# Altium project MXB-0036-B01.PrjPcb
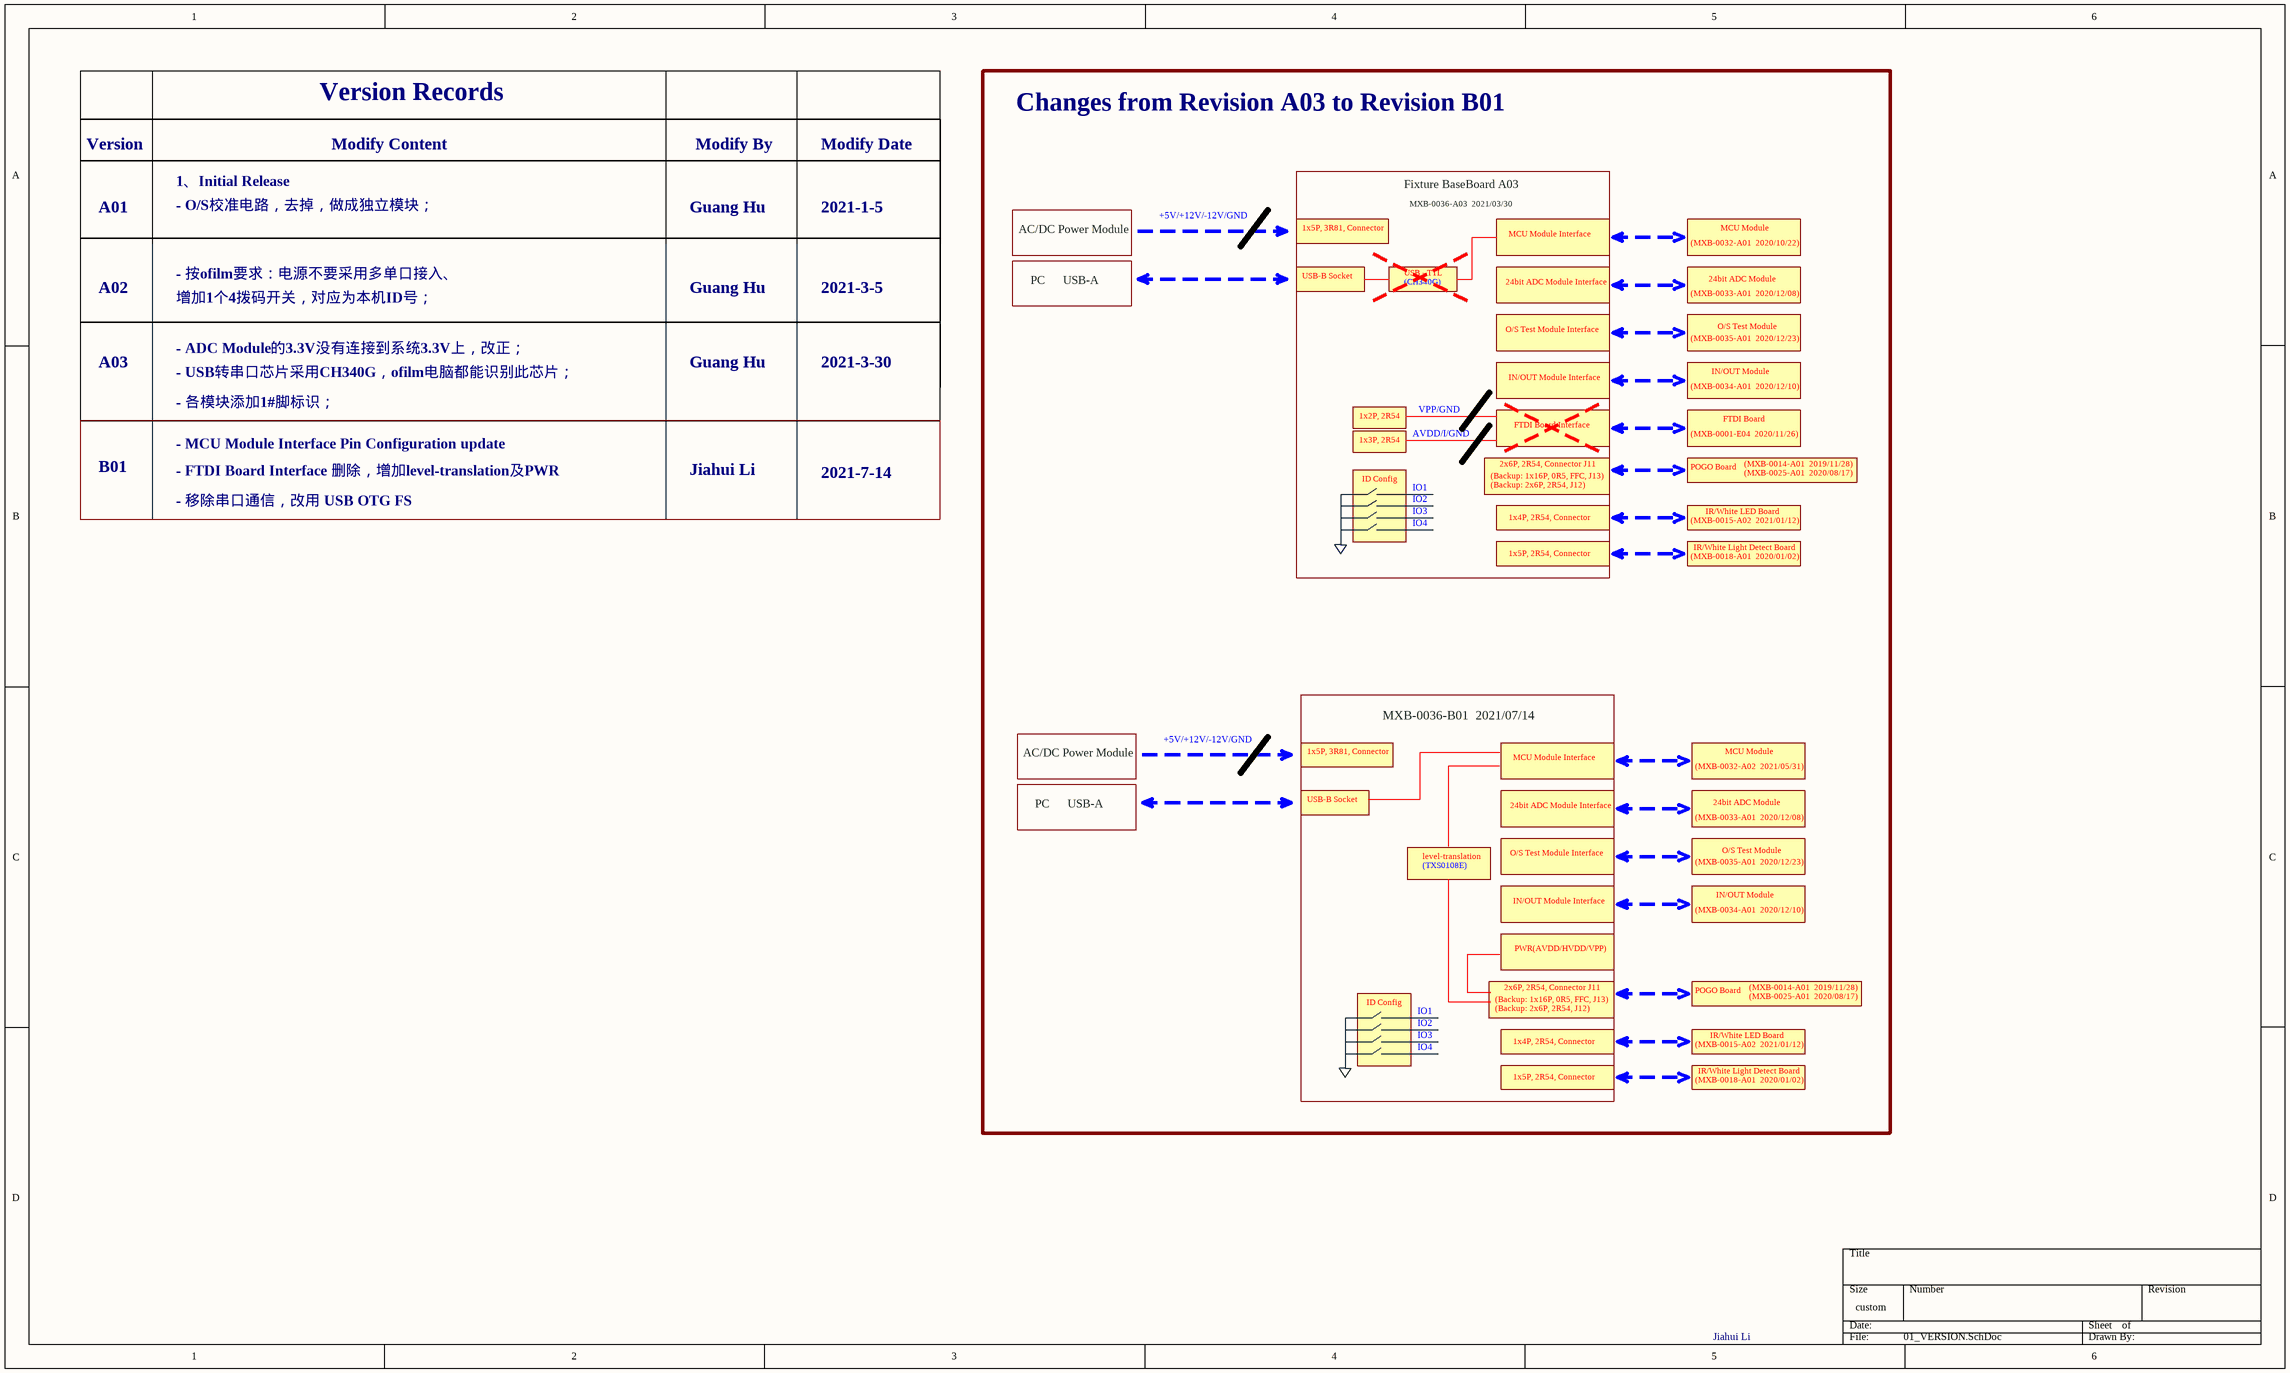
[diagram p0: 01_VERSION.SchDoc]
2 sheets, 157 parts. Net scope: global (net labels, ports and power ports of the same name join across sheets).
Board file: BaseBoard B01.PcbDoc
Sheets:
  01_VERSION.SchDoc
  02_Fixture BaseBoard B01.SchDoc

## Sheet 01_VERSION.SchDoc: MXB-0036-B01
size 485 x 289 mm; ApprovedBy: Jiahui Li; CheckedBy: Jiahui Li; Author: Jiahui Li; CompanyName: Mixosense; DrawnBy: Jiahui Li; Engineer: Jiahui Li; Organization: Mixosense; Revision: B01; SheetNumber: 1; SheetTotal: 2

### Notes on the sheet
- Version Records
- Changes from Revision A03 to Revision B01
- Version
- 1、Initial Release
- Modify Content
- Modify By
- Modify Date
- Fixture BaseBoard A03
- A01
- - O/S校准电路，去掉，做成独立模块；
- Guang Hu
- 2021-1-5
- AC/DC Power Module
- +5V/+12V/-12V/GND
- 1x5P, 3R81, Connector
- MXB-0036-A03  2021/03/30
- MCU Module Interface
- (MXB-0032-A01  2020/10/22)
- MCU Module
- A02
- - 按ofilm要求：电源不要采用多单口接入、
- 增加1个4拨码开关，对应为本机ID号；
- 2021-3-5
- PC      USB-A
- USB-B Socket
- USB - TTL
- (CH340G)
- 24bit ADC Module Interface
- (MXB-0033-A01  2020/12/08)
- 24bit ADC Module
- A03
- - ADC Module的3.3V没有连接到系统3.3V上，改正；
- - USB转串口芯片采用CH340G，ofilm电脑都能识别此芯片；
- 2021-3-30
- O/S Test Module Interface
- (MXB-0035-A01  2020/12/23)
- IN/OUT Module
- O/S Test Module
- - 各模块添加1#脚标识；
- 1x2P, 2R54
- AVDD/I/GND
- VPP/GND
- IN/OUT Module Interface
- FTDI Board Interface
- (MXB-0034-A01  2020/12/10)
- (MXB-0001-E04  2020/11/26)
- FTDI Board
- B01
- - MCU Module Interface Pin Configuration update
- - FTDI Board Interface 删除，增加level-translation及PWR
- Jiahui Li
- 2021-7-14
- 1x3P, 2R54
- ID Config
- IO1
- (Backup: 1x16P, 0R5, FFC, J13)
- (Backup: 2x6P, 2R54, J12)
- 2x6P, 2R54, Connector J11
- POGO Board
- (MXB-0014-A01  2019/11/28)
- (MXB-0025-A01  2020/08/17)
- - 移除串口通信，改用 USB OTG FS
- IO2
- IO3
- IO4
- 1x4P, 2R54, Connector
- 1x5P, 2R54, Connector
- (MXB-0015-A02  2021/01/12)
- IR/White Light Detect Board
- IR/White LED Board
- (MXB-0018-A01  2020/01/02)
- MXB-0036-B01  2021/07/14
- (MXB-0032-A02  2021/05/31)
- level-translation
- (TXS0108E)
- PWR(AVDD/HVDD/VPP)

## Sheet 02_Fixture BaseBoard B01.SchDoc: MXB-0036-B01
size 485 x 289 mm; ApprovedBy: Jiahui Li; CheckedBy: Jiahui Li; Author: Jiahui Li; CompanyName: Mixosense; DrawnBy: Jiahui Li; Engineer: Jiahui Li; Organization: Mixosense; Revision: B01; SheetNumber: 2; SheetTotal: 2
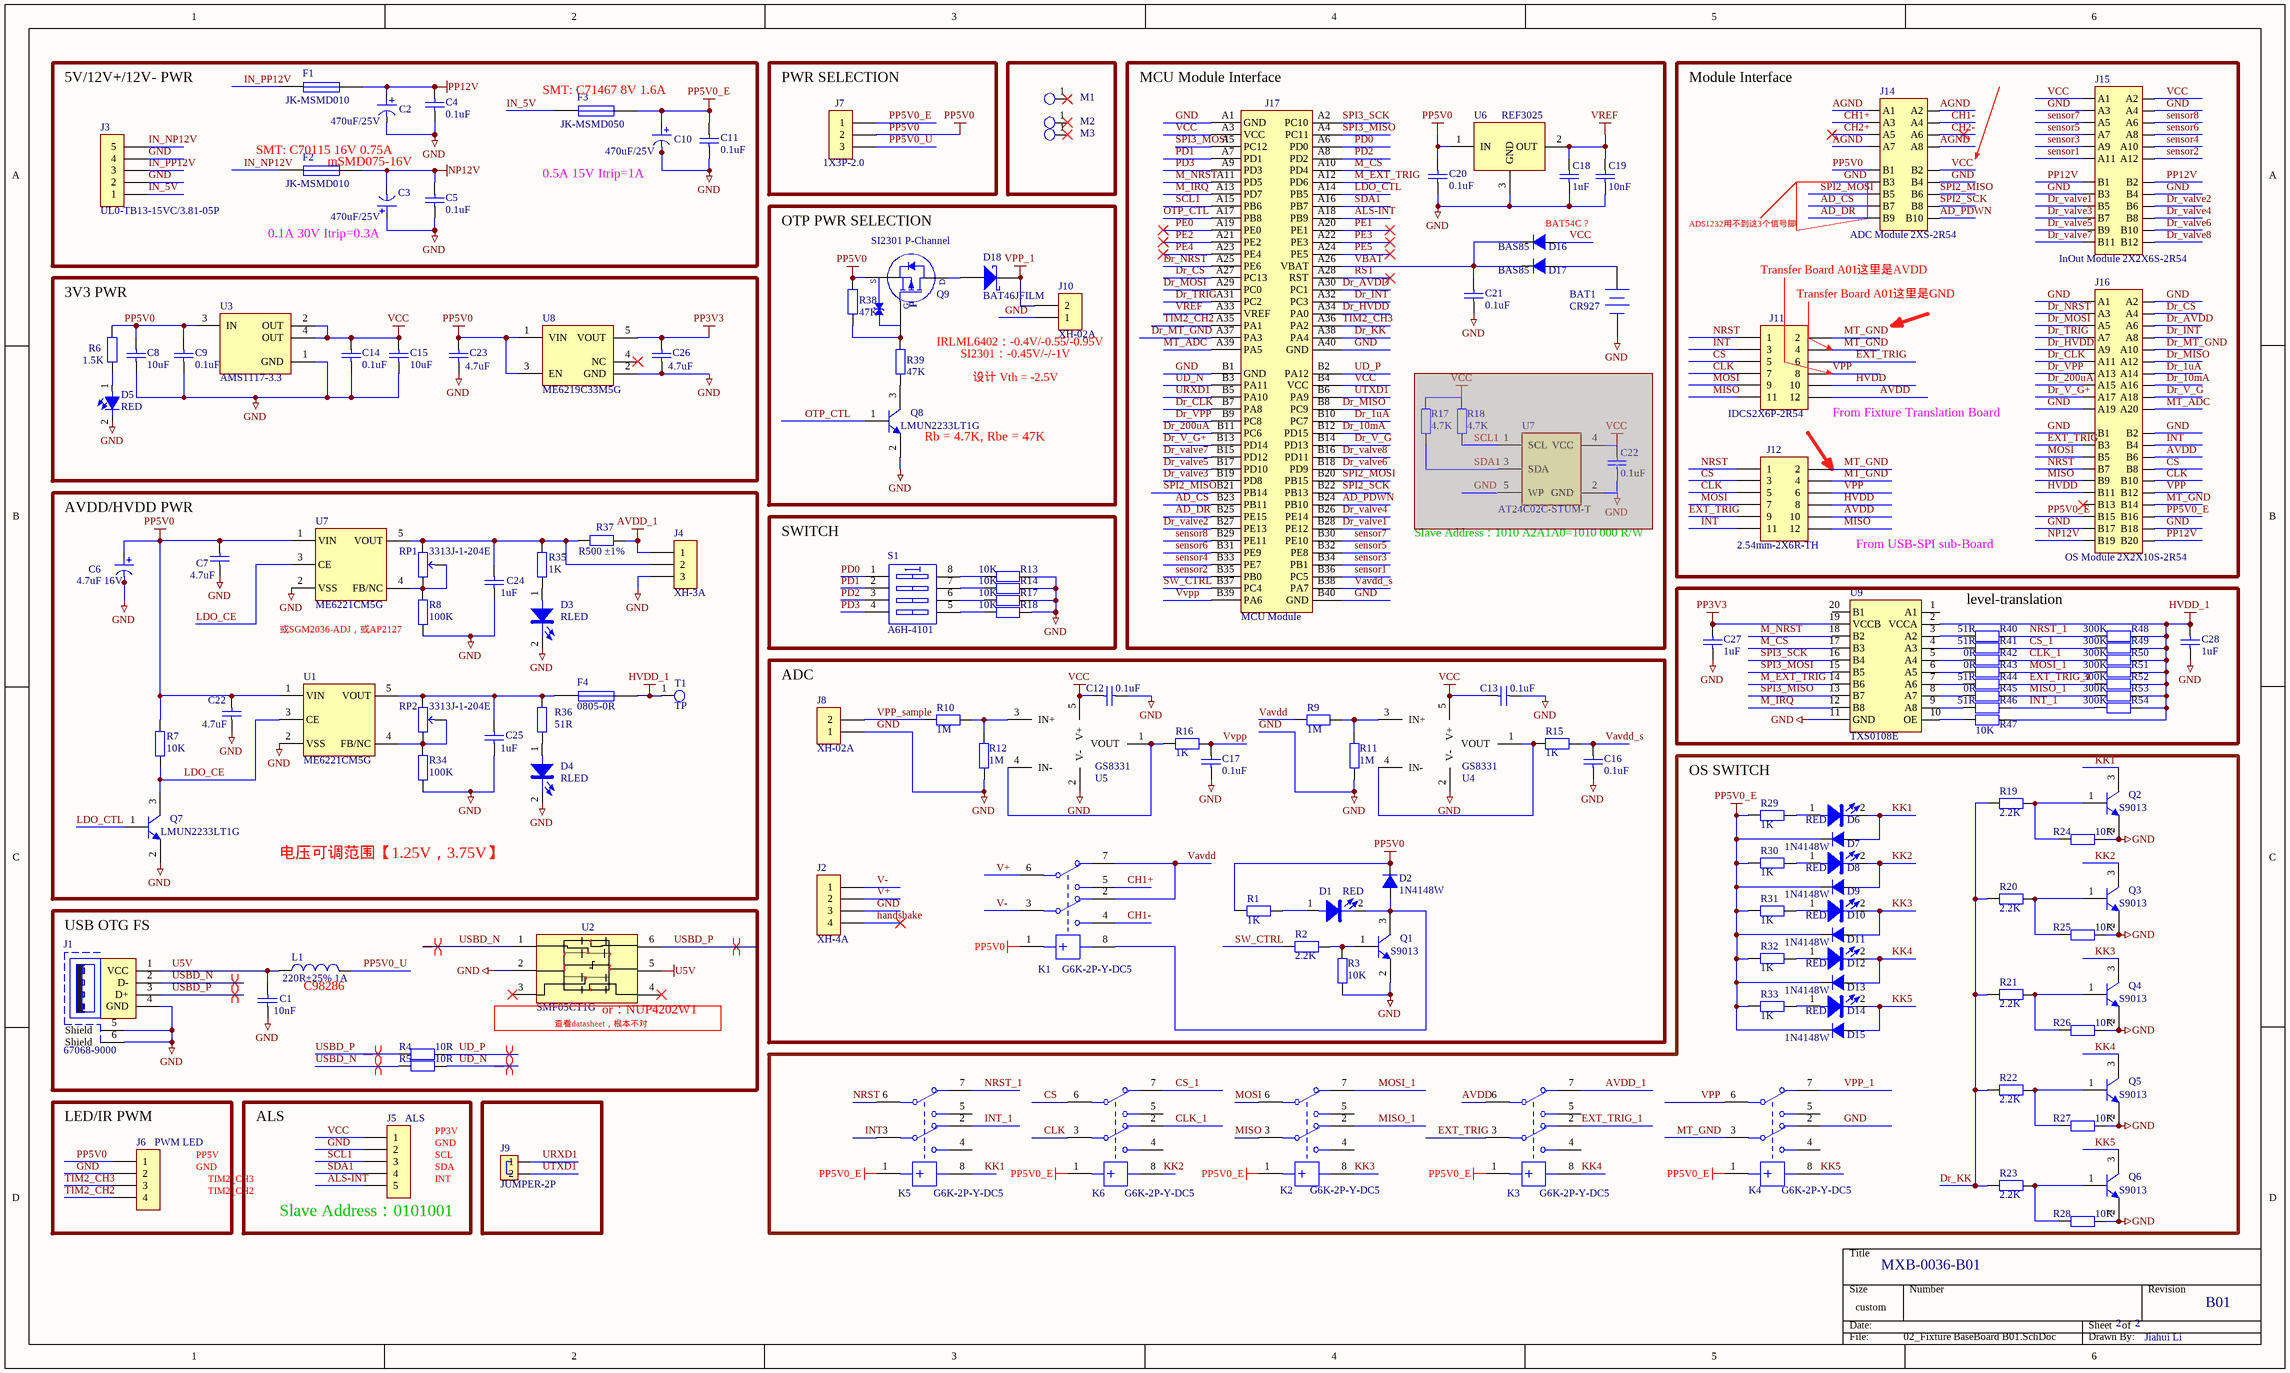
[diagram p1: 02_Fixture BaseBoard B01.SchDoc]

### Parts
(Parts that share a designator on the sheet are numbered #1, #2 ... from top to bottom, then left to right.)
BAT1  CR927  [CR2032]
C1  10nF  [HG-C0603]
C2  470uF/25V  [CE3R5-8x11R5-1mm]
C3  470uF/25V  [CE3R5-8x11R5-1mm]
C4  0.1uF  [HG-C0603]
C5  0.1uF  [HG-C0603]
C6  4.7uF 16V  [HG-C3216]
C7  4.7uF  [HG-C0402]
C8  10uF  [C0805]
C9  0.1uF  [HG-C0603]
C10  470uF/25V  [CE3R5-8x11R5-1mm]
C11  0.1uF  [HG-C0603]
C12  0.1uF  [HG-C0603]
C13  0.1uF  [HG-C0603]
C14  0.1uF  [HG-C0603]
C15  10uF  [C0805]
C16  0.1uF  [HG-C0603]
C17  0.1uF  [HG-C0603]
C18  1uF  [HG-C0603]
C19  10nF  [HG-C0603]
C20  0.1uF  [HG-C0603]
C21  0.1uF  [HG-C0603]
C22#1  0.1uF  [HG-C0603]  (masked out: inside a compile mask, not in the netlist)
C22#2  4.7uF  [HG-C0402]
C23  4.7uF  [HG-C0402]
C24  1uF  [HG-C0402]
C25  1uF  [HG-C0402]
C26  4.7uF  [HG-C0402]
C27  1uF  [HG-C0402]
C28  1uF  [HG-C0402]
D1  RED  [HG_LED_0603]
D2  1N4148W  [SOD-123]
D3  RLED  [HG_LED_0603]
D4  RLED  [HG_LED_0603]
D5  RED  [HG_LED_0603]
D6  RED  [HG_LED_0603]
D7  1N4148W  [SOD-123]
D8  RED  [HG_LED_0603]
D9  1N4148W  [SOD-123]
D10  RED  [HG_LED_0603]
D11  1N4148W  [SOD-123]
D12  RED  [HG_LED_0603]
D13  1N4148W  [SOD-123]
D14  RED  [HG_LED_0603]
D15  1N4148W  [SOD-123]
D16  BAS85  [SOD-80C]
D17  BAS85  [SOD-80C]
D18  BAT46JFILM  [SOD-323]
F1  JK-MSMD010  [FUSE-1812]
F2  JK-MSMD010  [FUSE-1812]
F3  JK-MSMD050  [FUSE-1812]
F4  0805-0R  [FUSE-0805]
J1  67068-9000  [USB-B-TH-W]
J2  XH-4A  [XH4P-2R54]
J3  UL0-TB13-15VC/3.81-05P  [2EDG5P-3R81-TH]
J4  XH-3A  [XH3P-2R54]
J5  ALS  [XH5P-2R5-TH]
J6  PWM LED  [XH4P-2R54-TH]
J7  1X3P-2.0  [CON3P-2R0]
J8  XH-02A  [XH2P-2R54]
J9  JUMPER-2P  [CON2P-2R0]
J10  XH-02A  [XH2P-2R54]
J11  IDCS2X6P-2R54  [IDCS2X6P-2R54-TH]
J12  2.54mm-2X6R-TH  [CON2X6R-2R54-TH]
J14  ADC Module 2XS-2R54  [ADC MODULE]
J15  InOut Module 2X2X6S-2R54  [INOUT MODULE]
J16  OS Module 2X2X10S-2R54  [OS MODULE]
J17  MCU Module  [MCU MODULE]
K1  G6K-2P-Y-DC5  [G6K-2P]
K2  G6K-2P-Y-DC5  [G6K-2P]
K3  G6K-2P-Y-DC5  [G6K-2P]
K4  G6K-2P-Y-DC5  [G6K-2P]
K5  G6K-2P-Y-DC5  [G6K-2P]
K6  G6K-2P-Y-DC5  [G6K-2P]
L1  220R±25% 1A  [L0603]
M1  (no value)  [MARK PAD]
M2  (no value)  [MARK PAD]
M3  (no value)  [MARK PAD]
Q1  S9013  [SOT-23-3]
Q2  S9013  [SOT-23-3]
Q3  S9013  [SOT-23-3]
Q4  S9013  [SOT-23-3]
Q5  S9013  [SOT-23-3]
Q6  S9013  [SOT-23-3]
Q7  LMUN2233LT1G  [SOT-23-3]
Q8  LMUN2233LT1G  [SOT-23-3]
Q9  SI2301 P-Channel  [SOT-23-MOS]
R1  1K  [HG-R0603]
R2  2.2K  [HG-R0603]
R3  10K  [HG-R0603]
R4  10R  [HG-R0603]
R5  10R  [HG-R0603]
R6  1.5K  [HG-R0603]
R7  10K  [HG-R0402]
R8  100K  [HG-R0402]
R9  1M  [HG-R0603]
R10  1M  [HG-R0603]
R11  1M  [HG-R0603]
R12  1M  [HG-R0603]
R13  10K  [HG-R0603]
R14  10K  [HG-R0603]
R15  1K  [HG-R0603]
R16  1K  [HG-R0603]
R17#1  4.7K  [HG-R0603]  (masked out: inside a compile mask, not in the netlist)
R17#2  10K  [HG-R0603]
R18#1  4.7K  [HG-R0603]  (masked out: inside a compile mask, not in the netlist)
R18#2  10K  [HG-R0603]
R19  2.2K  [HG-R0603]
R20  2.2K  [HG-R0603]
R21  2.2K  [HG-R0603]
R22  2.2K  [HG-R0603]
R23  2.2K  [HG-R0603]
R24  10K  [HG-R0603]
R25  10K  [HG-R0603]
R26  10K  [HG-R0603]
R27  10K  [HG-R0603]
R28  10K  [HG-R0603]
R29  1K  [HG-R0603]
R30  1K  [HG-R0603]
R31  1K  [HG-R0603]
R32  1K  [HG-R0603]
R33  1K  [HG-R0603]
R34  100K  [HG-R0402]
R35  1K  [HG-R0402]
R36  51R  [HG-R0402]
R37  R500 ±1%  [HG-R0603]
R38  47K  [HG-R0402]
R39  47K  [HG-R0402]
R40  51R  [HG-R0402]
R41  51R  [HG-R0402]
R42  0R  [HG-R0402]
R43  0R  [HG-R0402]
R44  51R  [HG-R0402]
R45  0R  [HG-R0402]
R46  51R  [HG-R0402]
R47  10K  [HG-R0402]
R48  300K  [HG-R0402]
R49  300K  [HG-R0402]
R50  300K  [HG-R0402]
R51  300K  [HG-R0402]
R52  300K  [HG-R0402]
R53  300K  [HG-R0402]
R54  300K  [HG-R0402]
RP1  3313J-1-204E  [3313J]
RP2  3313J-1-204E  [3313J]
S1  A6H-4101  [SW-SMD-6R31X4R5X1R27-4]
T1  TP  [TEST PAD]
U1  ME6221CM5G  [SOT23-5]
U2  SMF05CT1G  [SOT-363]
U3  AMS1117-3.3  [SOT-223]
U4  GS8331  [SOT23-5]
U5  GS8331  [SOT23-5]
U6  REF3025  [SOT23-3_REF]
U7#1  AT24C02C-STUM-T  [SOT23-5]  (masked out: inside a compile mask, not in the netlist)
U7#2  ME6221CM5G  [SOT23-5]
U8  ME6219C33M5G  [SOT23-5]
U9  TXS0108E  [TSSOP20-0R65-6R5X4R4]

### Blocks framed on the sheet
5V/12V+/12V- PWR: C2-C5 C10 C11 F1-F3 J3
PWR SELECTION: J7
MCU Module Interface: BAT1 C18-C21 C22#1 D16 D17 J17 R17#1 R18#1 U6 U7#1
Module Interface: J11 J12 J14-J16
OTP PWR SELECTION: D18 J10 Q8 Q9 R38 R39
3V3 PWR: C8 C9 C14 C15 C23 C26 D5 R6 U3 U8
电压可调范围【1.25V，3.75V】: C6 C7 C22#2 C24 C25 D3 D4 F4 J4 Q7 R7 R8 R34-R37 RP1 RP2 T1 U1 U7#2
SWITCH: R13 R14 R17#2 R18#2 S1
level-translation: C27 C28 R40-R54 U9
ADC: C12 C13 C16 C17 D1 D2 J2 J8 K1 Q1 R1-R3 R9-R12 R15 R16 U4 U5
OS SWITCH: D6-D15 K2-K6 Q2-Q6 R19-R33
USB OTG FS: C1 J1 L1 R4 R5 U2
LED/IR PWM: J6
Slave Address：0101001: J5

### Nets
AVDD_1: J4.1 K3.7 R37.2
GND: BAT1.2(-) C1.2 C2.2 C3.1 C4.2 C5.2 C6.2 C7.2 C8.2 C9.2 C10.2 C11.2 C12.2 C13.2 C14.2 C15.2 C16.2 C17.2 C18.2 C19.2 C20.1 C21.1 C22#2.2 C23.2 C24.2 C25.2 C26.2 C27.2 C28.2 D3.2 D4.2 D5.2 J1.4(GND) J1.5(Shield) J1.6(Shield) J2.3 J3.2 J3.4 J4.3 J5.2 J6.2 J8.1 J10.1 J14.B3 J14.B4 J15.A3 J15.A4 J15.B3 J15.B4 J16.A1 J16.A2 J16.A19 J16.B1 J16.B2 J16.B17 J16.B18 J17.A1(GND) J17.A40(GND) J17.B1(GND) J17.B40(GND) K4.2 Q1.2(E) Q2.2(E) Q3.2(E) Q4.2(E) Q5.2(E) Q6.2(E) Q7.2(E) Q8.2(E) R3.1 R8.2 R11.1 R12.1 R13.1 R14.1 R17#2.1 R18#2.1 R24.1 R25.1 R26.1 R27.1 R28.1 R34.2 U1.2(VSS) U2.2(VN) U3.1(GND) U4.2(V-) U5.2(V-) U6.3(GND) U7#2.2(VSS) U8.2(GND) U9.11(GND)
HVDD_1: C28.1 F4.2 R47.1 R48.1 R49.1 R50.1 R51.1 R52.1 R53.1 R54.1 T1.1 U9.2(VCCA)
NP12V: C3.2 C5.1 F2.2 J16.B19
PP3V3: C26.1 C27.1 U8.5(VOUT) U9.19(VCCB)
PP5V0: C6.1 C7.1 C8.1 C9.1 C20.2 C22#2.1 C23.1 D2.2(C) J6.1 J7.2 J14.B1 K1.1 Q9.S R1.1 R6.1 R7.1 R38.2 U1.1(VIN) U3.3(IN) U6.1(IN) U7#2.1(VIN) U8.1(VIN) U8.3(EN)
PP5V0_E: C10.1 C11.1 D7.2(C) D9.2(C) D11.2(C) D13.2(C) D15.2(C) F3.2 J7.1 J16.B15 J16.B16 K2.1 K3.1 K4.1 K5.1 K6.1 R29.1 R30.1 R31.1 R32.1 R33.1
PP12V: C2.1 C4.1 F1.2 J15.B1 J15.B2 J16.B20
U5V: C1.1 J1.1(VCC) L1.1 U2.5(VP)
VCC: C12.1 C13.1 C14.1 C15.1 D16.1(A) J5.1 J14.B2 J15.A1 J15.A2 J17.A3(VCC) J17.B4(VCC) U3.2(OUT) U3.4(OUT) U4.5(V+) U5.5(V+)
VPP_1: D18.2 J10.2 K4.7
VREF: C18.1 C19.1 J17.A33(VREF) U6.2(OUT)
AD_CS: J14.B7 J17.B23(PB11)
AD_DR: J14.B9 J17.B25(PE15)
AD_PDWN: J14.B10 J17.B24(PB10)
AGND: J14.A1 J14.A2 J14.A7 J14.A8
ALS-INT: J5.5 J17.A18(PB9)
AVDD: J11.12 J12.10 J16.B6 K3.6
CH1+: J14.A3 K1.5
CH1-: J14.A4 K1.4
CH2+: J14.A5
CH2-: J14.A6
CLK: J11.7 J12.5 J16.B10 K6.3
CLK_1: K6.2 R42.1 R50.2
CS: J11.5 J12.3 J16.B8 K6.6
CS_1: K6.7 R41.1 R49.2
Dr_1uA: J16.A14 J17.B10(PC7)
Dr_10mA: J16.A16 J17.B12(PD15)
Dr_200uA: J16.A15 J17.B11(PC6)
Dr_AVDD: J16.A6 J17.A30(PC1)
Dr_CLK: J16.A11 J17.B7(PA8)
Dr_CS: J16.A4 J17.A27(PC13)
Dr_HVDD: J16.A9 J17.A34(PA0)
Dr_INT: J16.A8 J17.A32(PC3)
Dr_KK: J17.A38(PA4) R19.1 R20.1 R21.1 R22.1 R23.1
Dr_MISO: J16.A12 J17.B8(PC9)
Dr_MOSI: J16.A5 J17.A29(PC0)
Dr_MT_GND: J16.A10 J17.A37(PA3)
Dr_NRST: J16.A3 J17.A25(PE6)
Dr_TRIG: J16.A7 J17.A31(PC2)
Dr_V_G: J16.A18 J17.B14(PD13)
Dr_V_G+: J16.A17 J17.B13(PD14)
Dr_valve1: J15.B5 J17.B28(PE12)
Dr_valve2: J15.B6 J17.B27(PE13)
Dr_valve3: J15.B7 J17.B19(PD8)
Dr_valve4: J15.B8 J17.B26(PE14)
Dr_valve5: J15.B9 J17.B17(PD10)
Dr_valve6: J15.B10 J17.B18(PD9)
Dr_valve7: J15.B11 J17.B15(PD12)
Dr_valve8: J15.B12 J17.B16(PD11)
Dr_VPP: J16.A13 J17.B9(PC8)
EXT_TRIG: J11.6 J12.9 J16.B3 K3.3
EXT_TRIG_1: K3.2 R44.1 R52.2
handshake: J2.4
HVDD: J11.10 J12.8 J16.B11
IN_5V: F3.1 J3.1
IN_NP12V: F2.1 J3.5
IN_PP12V: F1.1 J3.3
INT: J11.3 J12.11 J16.B4 K5.3
INT_1: K5.2 R46.1 R54.2
KK1: D6.2 D7.1(A) K5.8 Q2.3(C)
KK2: D8.2 D9.1(A) K6.8 Q3.3(C)
KK3: D10.2 D11.1(A) K2.8 Q4.3(C)
KK4: D12.2 D13.1(A) K3.8 Q5.3(C)
KK5: D14.2 D15.1(A) K4.8 Q6.3(C)
LDO_CE: Q7.3(C) R7.2 U1.3(CE) U7#2.3(CE)
LDO_CTL: J17.A14(PB5) Q7.1(B)
M_CS: J17.A10(PD4) U9.17(B3)
M_EXT_TRIG: J17.A12(PD6) U9.14(B6)
M_IRQ: J17.A13(PD7) U9.12(B8)
M_NRST: J17.A11(PD5) U9.18(B2)
MISO: J11.11 J12.12 J16.B9 K2.3
MISO_1: K2.2 R45.1 R53.2
MOSI: J11.9 J12.7 J16.B5 K2.6
MOSI_1: K2.7 R43.1 R51.2
MT_ADC: J16.A20 J17.A39(PA5)
MT_GND: J11.2 J11.4 J12.2 J12.4 J16.B14 K4.3
NRST: J11.1 J12.1 J16.B7 K5.6
NRST_1: K5.7 R40.1 R48.2
OTP_CTL: J17.A17(PB8) Q8.1(B)
PD0: J17.A6(PD0) S1.1(A1)
PD1: J17.A7(PD1) S1.2(A2)
PD2: J17.A8(PD2) S1.3(A3)
PD3: J17.A9(PD3) S1.4(A4)
PE0: J17.A19(PE0)
PE1: J17.A20(PE1)
PE2: J17.A21(PE2)
PE3: J17.A22(PE3)
PE4: J17.A23(PE4)
PE5: J17.A24(PE5)
PP5V0_U: J7.3 L1.2
RST: J17.A28(RST)
SCL1: J5.3 J17.A15(PB6)
SDA1: J5.4 J17.A16(PB7)
sensor1: J15.A11 J17.B36(PC5)
sensor2: J15.A12 J17.B35(PB0)
sensor3: J15.A9 J17.B34(PB1)
sensor4: J15.A10 J17.B33(PE7)
sensor5: J15.A7 J17.B32(PE8)
sensor6: J15.A8 J17.B31(PE9)
sensor7: J15.A5 J17.B30(PE10)
sensor8: J15.A6 J17.B29(PE11)
SPI2_MISO: J14.B6 J17.B21(PB14)
SPI2_MOSI: J14.B5 J17.B20(PB15)
SPI2_SCK: J14.B8 J17.B22(PB13)
SPI3_MISO: J17.A4(PC11) U9.13(B7)
SPI3_MOSI: J17.A5(PC12) U9.15(B5)
SPI3_SCK: J17.A2(PC10) U9.16(B4)
SW_CTRL: J17.B37(PC4) R2.1
TIM2_CH2: J6.4 J17.A35(PA1)
TIM2_CH3: J6.3 J17.A36(PA2)
UD_N: J17.B3(PA11) R5.1
UD_P: J17.B2(PA12) R4.1
URXD1: J9.1 J17.B5(PA10)
USBD_N: J1.2(D-) R5.2 U2.1(I/O1)
USBD_P: J1.3(D+) R4.2 U2.6(I/O2)
UTXD1: J9.2 J17.B6(PA9)
V+: J2.2 K1.6
V-: J2.1 K1.3
Vavdd: K1.2 K1.7 R9.2
Vavdd_s: C16.1 J17.B38(PA7) R15.1
VBAT: C21.2 D16.2(C) D17.2(C) J17.A26(VBAT)
VPP: J11.8 J12.6 J16.B12 K4.6
VPP_sample: J8.2 R10.2
Vvpp: C17.1 J17.B39(PA6) R16.1
NetBAT1_1: BAT1.1(+) D17.1(A)
NetC24_1: C24.1 J4.2 R35.1 R37.1 RP1.1 U7#2.5(VOUT)
NetC25_1: C25.1 F4.1 R36.1 RP2.1 U1.5(VOUT)
NetD1_1: D1.1 R1.2
NetD1_2: D1.2 D2.1(A) K1.8 Q1.3(C)
NetD3_1: D3.1 R35.2
NetD4_1: D4.1 R36.2
NetD5_1: D5.1 R6.2
NetD6_1: D6.1 R29.2
NetD8_1: D8.1 R30.2
NetD10_1: D10.1 R31.2
NetD12_1: D12.1 R32.2
NetD14_1: D14.1 R33.2
NetD18_1: D18.1 Q9.D
NetQ1_1: Q1.1(B) R2.2 R3.2
NetQ2_1: Q2.1(B) R19.2 R24.2
NetQ3_1: Q3.1(B) R20.2 R25.2
NetQ4_1: Q4.1(B) R21.2 R26.2
NetQ5_1: Q5.1(B) R22.2 R27.2
NetQ6_1: Q6.1(B) R23.2 R28.2
NetQ8_3: Q8.3(C) R39.1
NetQ9_G: Q9.G R38.1 R39.2
NetR8_1: R8.1 RP1.2 RP1.3 U7#2.4(FB/NC)
NetR9_1: R9.1 R11.2 U4.3(IN+)
NetR10_1: R10.1 R12.2 U5.3(IN+)
NetR13_2: R13.2 S1.8(A8)
NetR14_2: R14.2 S1.7(A7)
NetR15_2: R15.2 U4.1(VOUT) U4.4(IN-)
NetR16_2: R16.2 U5.1(VOUT) U5.4(IN-)
NetR17#2_2: R17#2.2 S1.6(A6)
NetR18#2_2: R18#2.2 S1.5(A5)
NetR34_1: R34.1 RP2.2 RP2.3 U1.4(FB/NC)
NetR40_2: R40.2 U9.3(A2)
NetR41_2: R41.2 U9.4(A3)
NetR42_2: R42.2 U9.5(A4)
NetR43_2: R43.2 U9.6(A5)
NetR44_2: R44.2 U9.7(A6)
NetR45_2: R45.2 U9.8(A7)
NetR46_2: R46.2 U9.9(A8)
NetR47_2: R47.2 U9.10(OE)

Not connected (* = marked no-connect by the designer): J16 B13*; K2 4 5; K3 4 5; K4 4 5; K5 4 5; K6 4 5; M1 1*; M2 1*; M3 1*; U2 3(I/O3)* 4(I/O4)*; U8 4(NC)*; U9 1(A1) 20(B1)

### Layout directives
differential pair: UD_N, UD_P, USBD_N, USBD_P

### Notes on the sheet
- (near F3) SMT: C71467 8V 1.6A
- (near F2) SMT: C70115 16V 0.75A
- (near F2) mSMD075-16V
- (near C10) 0.5A 15V Itrip=1A
- (near C3) 0.1A 30V Itrip=0.3A
- (near D16) BAT54C ?
- ADS1232用不到这3个信号脚
- Transfer Board A01这里是AVDD
- (near J11) Transfer Board A01这里是GND
- (near J10) IRLML6402：-0.4V/-0.55/-0.95V
- (near J10) SI2301：-0.45V/-/-1V
- 设计 Vth = -2.5V
- (near J11) From Fixture Translation Board
- (near Q8) Rb = 4.7K, Rbe = 47K
- (near C6) AVDD/HVDD PWR
- (near U7#1) Slave Address：1010 A2A1A0=1010 000 R/W
- From USB-SPI sub-Board
- 或SGM2036-ADJ，或AP2127
- (near L1) C98286
- (near U2) 查看datasheet，根本不对
- (near U2) or：NUP4202W1
- ALS
- (near J5) PP3V
- (near J5) GND
- (near J6) PP5V
- (near J6) GND
- (near J6) TIM2_CH2
- (near J6) TIM2_CH3
- (near J5) SCL
- (near J5) SDA
- (near J5) INT
- (in symbol 101MP-00005AM.01) P

### Library data of the parts
BAT1 = Battery: Multicell Battery; Published: 24-Mar-1999; LatestRevisionDate: 17-Jul-2002; LatestRevisionNote: Re-released for DXP Platform.; PackageReference: BAT-2; Publisher: Altium Limited
C1 C4 C5 C7-C9 C11-C21 C22#1 C22#2 C23-C28 = 101CC-00174-0.01: SMD,电容量470nF,额定电压50V,偏差±10%,材质X7R,0603; Allow Altenative Part: Y; serial number: 13; Categories: 电容; Value: 470nF; Tolerance: ±10%; Rated Voltage: 50V; Temperature Coefficient: X7R; COMPONENTLINK 1 DESCRIPTION: GetDatasheet; Remark: Verified by BU1（黄雄青） check list V1.0; Modify time: 2015年11月04号; Approved: YES; Part Number: 101CC-00174-0.01; Category: 贴片电容; PACKAGE: Tape&Reel; Mounting Type: SurfaceMount; Size: 0603
C2 C3 C10 = 102CE-00011BM.01: DIP,电容量100uF,额定电压50V,偏差±20%,8X11.5mm; Allow Altenative Part: Y; serial number: 17; Categories: 电容; Value: 100uF; Tolerance: ±20%; Rated Voltage: 50V; COMPONENTLINK 1 DESCRIPTION: ShowDatasheet; Remark: Verified by BU1（黄雄青） check list V1.0; Modify time: 2016年10月28号; Approved: YES; Part Number: 102CE-00011BM.01; Category: 电解电容; Operating Temperature: -40°C ~ 105°C; PACKAGE: Bulk; Mounting Type: ThroughHole; Applications: Automotive; Size: 8; Max Thickness: 11.5; Supplier 1: RUBYCON; Supplier Part Number 1: 50YXG100MEFC8*11.5; Pricing 1: Jan/00; COMPONENTLINK 1 URL: http://www.rubycon.co.jp/en/catalog/e_pdfs/aluminum/e_yxg.pdf; MOQ: Jun/05
C6 = 102CE-00107OD.01: DIP,电容量220uF,额定电压16V,偏差±20%,6x11mm; Allow Altenative Part: Y; serial number: 3; Categories: 电容; Value: 220uF; Tolerance: ±20%; COMPONENTLINK 1 DESCRIPTION: ShowDatasheet; Remark: Verified by BU1（黄雄青） check list V1.0; Modify time: 2015年07月10号; Approved: YES; Part Number: 102CE-00107OD.01; Category: 电解电容; Rated Voltage: 16V; Operating Temperature: -40°C~85°C; PACKAGE: Bulk; Mounting Type: ThroughHole; Applications: Automotive; Size: 6.3; Max Thickness: 11; Supplier 1: TDK; Supplier Part Number 1: B41827A4227M; Pricing 1: 0.24; COMPONENTLINK 1 URL: http://media.digikey.com/pdf/Data%20Sheets/Epcos%20PDFs/B41827_B43827.pdf; MOQ: 5000
D1 D3-D6 D8 D10 D12 D14 = LED-2
D2 D7 D9 D11 D13 D15-D17 = DIODE
D18 = 101DS-00001BK.01: 安装方式SMD,封装外壳SOD-323,额定电压 100V,电流150mA; Allow Altenative Part: Y; serial number: 208; Categories: 二极管; Rated Current: 150mA; COMPONENTLINK 1 DESCRIPTION: GetDatasheet; Modify time: 2018年9月15号; Part Number: 101DS-00001BK.01; Category: 肖特基二极管; Value: BAT46JFILM; Rated Voltage: 100V; PACKAGE: Tape&Reel; Mounting Type: SurfaceMount; Supplier 1: ST; Supplier Part Number 1: BAT46JFILM; COMPONENTLINK 1 URL: http://www.mouser.cn/datasheet/2/389/bat46-954457.pdf
F1-F3 = 101FP-00008BI.01: SMD,1812,额定电压6V,额定电流3.5A,中速断; Allow Altenative Part: Y; serial number: 24; Categories: 保险丝; Value: mSMD350; Rated Voltage: 6V; Rated Current: 3.5A; COMPONENTLINK 1 DESCRIPTION: GetDatasheet; Remark: Verified by BU1（黄雄青） check list V1.0; Modify time: 2015年07月10号; Approved: YES; Part Number: 101FP-00008BI.01; Category: 自恢复保险丝; PACKAGE: Tape&Reel; Mounting Type: SurfaceMount; Supplier 1: SEA&LAND; Supplier Part Number 1: MSMD350; Pricing 1: 0.25; COMPONENTLINK 1 URL: http://www.littelfuse.name/te_product_d_c914/2013-10-16/7228.chtml; MOQ: May/01
F4 = 101FP-00089BI.01: SMD,0805,额定电压6V,额定电流1A,慢断; Allow Altenative Part: Y; serial number: 10; Categories: 保险丝; Value: SMD0805-100; Rated Voltage: 6V; Rated Current: 1A; COMPONENTLINK 1 DESCRIPTION: GetDatasheet; Remark: Verified by BU1（黄雄青） check list V1.0; Modify time: 2015年07月10号; Approved: YES; Part Number: 101FP-00089BI.01; Category: 自恢复保险丝; PACKAGE: Tape&Reel; Mounting Type: SurfaceMount; Supplier 1: SEA&LAND; Supplier Part Number 1: SMD0805-100; Pricing 1: 0.35; COMPONENTLINK 1 URL: http://www.littelfuse.name/te_product_d_c914/2013-10-15/6828.chtml; MOQ: May/01
J1 = 101OC-00008MP.01: 替代料号：102OC-00027MP.01，安装方式SMD,B口，封装尺寸17*12*7.78mm，镀金/白色，连接角度90度，4+2PIN; Allow Altenative Part: Y; serial number: 163; Categories: 插座; COMPONENTLINK 1 DESCRIPTION: GetDatasheet; Remark: 苏州BU1; Modify time: 2018年3月3号; Part Number: 101OC-00008MP.01; Category: USB2.0插座; Value: 67068-9000; PACKAGE: Pipefittings; Mounting Type: SurfaceMount; Size: 17*12*7.78mm; Supplier 1: MOLEX; Supplier Part Number 1: 67068-9000; COMPONENTLINK 1 URL: https://www.molex.com/pdm_docs/sd/670689000_sd.pdf
J2 J6 = 102NB-00025CY.01: DIP,座子,封装脚距2.54mm,180度,1x4PIN,塑高/针长7.0/3.40mm,白色; Allow Altenative Part: Y; serial number: 193; Categories: 连接器; Value: W7810411120AB; COMPONENTLINK 1 DESCRIPTION: GetDatasheet; Remark: Verified by CRD（赖程奇） check list V1.0; Modify time: 2016年05月12号; Approved: YES; Part Number: 102NB-00025CY.01; Category: XH连接器; PACKAGE: Bulk; Mounting Type: ThroughHole; Supplier 1: 富盈源; Supplier Part Number 1: W7810411120AB; Pricing 1: 3.8; COMPONENTLINK 1 URL: http://www.fyconn.com/productView.asp?id=340; MOQ: 500
J3 = 102ND-00009FN.01: 安装方式DIP,座子,封装脚距3.81mm,180度,5PIN,塑高/针长9.2/3.5mm,绿色,不带螺柱; Allow Altenative Part: Y; serial number: 704; Categories: 连接器; COMPONENTLINK 1 DESCRIPTION: GetDatasheet; Modify time: 2018年11月3号; Part Number: 102ND-00009FN.01; Category: 插拔式连接器; Value: UL0-TB13-15VC/3.81-05P; PACKAGE: Bulk; Mounting Type: ThroughHole; Supplier 1: 欧路; Supplier Part Number 1: UL0-TB13-15VC/3.81-05P; COMPONENTLINK 1 URL: http://www.ulo-group.com/productdetail.html?pid=227
J4 = 102NB-00017CY.01: DIP,座子,封装脚距2.54mm,180度,1x3PIN,塑高/针长7.0/3.40mm,白色; Allow Altenative Part: Y; serial number: 28; Categories: 连接器; Value: W7810311120AB; COMPONENTLINK 1 DESCRIPTION: GetDatasheet; Remark: Verified by CRD（赖程奇） check list V1.0; Modify time: 2015年11月06号; Approved: YES; Part Number: 102NB-00017CY.01; Category: XH连接器; PACKAGE: Bulk; Mounting Type: ThroughHole; Supplier 1: 富盈源; Supplier Part Number 1: W7810311120AB; Pricing 1: 0.35; COMPONENTLINK 1 URL: http://www.fyconn.com/productView.asp?id=445; MOQ: 500
J5 = 102NB-00021MM.01: DIP,座子,封装脚距2.5mm,180度,1x5PIN,塑高/针长7.0/3.40mm,白色，50PCS/包; Allow Altenative Part: Y; serial number: 33; Categories: 连接器; Value: NYXH-5-BM-50P; COMPONENTLINK 1 DESCRIPTION: GetDatasheet; Remark: Verified by BU3（杨培）& BU4（陈雪莹）& CRD（赖程奇） check list V1.0; Modify time: 2015年07月10号; Approved: YES; Part Number: 102NB-00021MM.01; Category: XH连接器; PACKAGE: Bulk; Mounting Type: ThroughHole; Supplier 1: misumi; Supplier Part Number 1: NYXH-5-BM-50P; Pricing 1: 0.13; COMPONENTLINK 1 URL: http://cn.misumi-ec.com/pdf/el/2014/cn3589.pdf; MOQ: 500
J7 = 102NL-00028BV.01: DIP,封装脚距2mm,180度,1x3PIN,上针/下针4.0/2.8mm,黑色; Allow Altenative Part: Y; serial number: 230; Categories: 连接器; Value: 62000311121; COMPONENTLINK 1 DESCRIPTION: GetDatasheet; Remark: Verified by CRD（赖程奇） check list V1.0; Modify time: 2017年01月07号; Approved: YES; Part Number: 102NL-00028BV.01; Category: 单排针; PACKAGE: Bulk; Mounting Type: ThroughHole; Supplier 1: wurth; Supplier Part Number 1: 62000311121; Pricing 1: 94; COMPONENTLINK 1 URL: http://katalog.we-online.de/em/datasheet/6200xx11121.pdf
J8 J10 = 102NB-00022CY.01: DIP,座子,封装脚距2.54mm,180度,1x2PIN,塑高/针长7.0/3.40mm,白色; Allow Altenative Part: Y; serial number: 39; Categories: 连接器; COMPONENTLINK 1 DESCRIPTION: GetDatasheet; Remark: Verified by CRD（赖程奇） check list V1.0; Modify time: 2016年1月11号; Approved: YES; Preferred: P; Part Number: 102NB-00022CY.01; Category: XH连接器; Value: XH-02A; PACKAGE: Bulk; Mounting Type: ThroughHole; Supplier 1: 富盈源; Supplier Part Number 1: XH-02A; Pricing 1: 0.251; COMPONENTLINK 1 URL: http://www.fyconn.com/uploadfile/jpg/324.jpg; MOQ: 100
J11 = 102NE-00156CY.01: DIP,座子,封装脚距2.54mm,180度,2x6PIN,塑高/针长8.8/3.2mm,黑色,套件无; Allow Altenative Part: Y; serial number: 224; Categories: 连接器; Value: B7021211110GA; COMPONENTLINK 1 DESCRIPTION: GetDatasheet; Remark: Verified by CRD（赖程奇） check list V1.0; Modify time: 2017年01月07号; Approved: YES; Part Number: 102NE-00156CY.01; Category: IDC连接器; PACKAGE: Bulk; Mounting Type: ThroughHole; Supplier 1: 富盈源; Supplier Part Number 1: B7021211110GA; Pricing 1: 94
J12 = 102NO-00007BV.01: DIP,封装脚距2.54mm,180度,2x6PIN,黑色; Allow Altenative Part: Y; serial number: 116; Categories: 连接器; Value: 61301221821; COMPONENTLINK 1 DESCRIPTION: GetDatasheet; Remark: Verified by CRD（赖程奇） check list V1.0; Modify time: 2015年07月10号; Approved: YES; Part Number: 102NO-00007BV.01; Category: 双排母; PACKAGE: Bulk; Mounting Type: ThroughHole; Supplier 1: wurth; Supplier Part Number 1: 61301221821; Pricing 1: 1.03; COMPONENTLINK 1 URL: http://katalog.we-online.de/en/em/613_0xx_218_21/613_030_218_21?m=n&sp=http%3A%2F%2Fwww.we-online.de%2Fweb%2Fen%2Felectronic_components%2Fsearchpage_PBS.php%3Fsearch%3D61303021821; MOQ: 500
J14 = ADC Module
J15 = InOut Module
J16 = OS Module
K1-K6 = DPDT
L1 = 101LF-00024OD.01: SMD,电感值无,额定电流1A,屏蔽式,0603,阻值/频率470R/100MHz; Allow Altenative Part: Y; serial number: 6; Categories: 电感; Tolerance: ±25%; COMPONENTLINK 1 DESCRIPTION: OpenDatasheet; Remark: Verified by BU1（黄雄青） check list V1.0; Modify time: 2015年08月04号; Approved: YES; Preferred: P; Part Number: 101LF-00024OD.01; Category: 磁珠; Value: 470R/100MHz; Rated Current: 1A; PACKAGE: Tape&Reel; Mounting Type: SurfaceMount; Size: 0603; Supplier 1: TDK; Supplier Part Number 1: MPZ1608B471ATA00; Pricing 1: Jan/00; COMPONENTLINK 1 URL: http://product.tdk.com; MOQ: Dec/10
M1-M3 = Test Pad
Q1-Q8 = NPN: NPN Bipolar Transistor; Published: 8-Jun-2000; LatestRevisionDate: 17-Jul-2002; LatestRevisionNote: Re-released for DXP Platform.; PackageReference: TO-226; Publisher: Altium Limited; Code_JEDEC: TO-226-AA
Q9 = 101MP-00005AM.01: SMD,封装方式SOT-23,额定电压30V,耗散功率500mW,Vgs1V,额定电流2A; Allow Altenative Part: Y; serial number: 18; Categories: MOS管; Value: BSS308PEH6327; Rated Power: 500mW; Rated Voltage: 30V; Rated Current: 2A; Other: Vgs:1V; COMPONENTLINK 1 DESCRIPTION: OpenDatasheet; Remark: Verified by BU3（吴明徽） check list V1.0; Modify time: 2015年07月10号; Approved: YES; Part Number: 101MP-00005AM.01; Category: P型MOS管; PACKAGE: Tape&Reel; Mounting Type: SurfaceMount; Size: SOT-23; Supplier 1: Infineon; Supplier Part Number 1: BSS308PEH6327; Pricing 1: 0.6867; COMPONENTLINK 1 URL: http://www.infineon.com/dgdl/BSS308PE_Rev2.03.pdf?folderId=db3a304314dca38901154a72e3951a65&fileId=db3a304330f686060131099c80400073; MOQ: Sep/02
R1-R16 R17#1 R17#2 R18#1 R18#2 R19-R54 = R0603: Part Number: R0603; Allow Altenative Part: Y; serial number: 4; Categories: 电阻; Remark: BU 需求; Modify time: 2017年03月06号; Approved: YES; Category: 贴片电阻; PACKAGE: Tape&Reel; Mounting Type: SurfaceMount
RP1 RP2 = 102RT-00008AO.01: DIP,阻值2K,精度±10%,10x9.5x4.8mm,额定功率1/2W; Allow Altenative Part: Y; serial number: 23; Categories: 电阻; Value: 2K; Tolerance: ±10%; Rated Power: 1/2W; COMPONENTLINK 1 DESCRIPTION: OpenDatasheet; Remark: Verified by BU3（吴明徽）check list V1.0; Modify time: 2015年11月30号; Approved: YES; Part Number: 102RT-00008AO.01; Category: 可调电阻; PACKAGE: Bulk; Mounting Type: ThroughHole; Size: 10x9.5x4.8mm; Supplier 1: BOURNS; Supplier Part Number 1: 3296W-1-202-A-LF; Pricing 1: Jan/00; COMPONENTLINK 1 URL: http://www.bourns.com/data/global/pdfs/3296.pdf; MOQ: 1000
S1 = 101SB-00003AZ.01: 安装方式SMD,封装/间距6.31x4.5x1.45/1.27mm,引脚数/位数8PIN/4位,电流25mA,长方体/黑色; Allow Altenative Part: Y; serial number: 31; Categories: 开关; Rated Current: 25mA; COMPONENTLINK 1 DESCRIPTION: OpenDatasheet; Modify time: 2018年7月28号; Part Number: 101SB-00003AZ.01; Category: 拨码开关; Value: A6H-4101; PACKAGE: Tape&Reel; Mounting Type: SurfaceMount; Size: 6.31x4.5x1.45/1.27mm; Supplier 1: omron; Supplier Part Number 1: A6H-4101; COMPONENTLINK 1 URL: http://omronfs.omron.com/en_US/ecb/products/pdf/en-a6h.pdf
U2 = TVS
U3 = 101IA-00331BN.01: SMD，SOT-223-4，4PIN，线性低压差稳压器(输入电压 2V~5.5V，输出电压1.2V，输出电流800mA); Allow Altenative Part: Y; serial number: 1037; Categories: IC; Value: TLV1117LV12DCYR; COMPONENTLINK 1 DESCRIPTION: OpenDatasheet; Modify time: 2018年12月22号; Part Number: 101IA-00331BN.01; Category: 电源管理IC; PACKAGE: Tape&Reel; Mounting Type: SurfaceMount; Supplier 1: TI; Supplier Part Number 1: TLV1117LV12DCYR; COMPONENTLINK 1 URL: http://www.ti.com/lit/ds/symlink/tlv1117lv.pdf
U4 U5 = 101IF-00183BN.01: SMD,SOT-23-5,5PIN,高速运算放大器（工作电压2.7V-5.5V，±1.35V-2.75V); Allow Altenative Part: Y; serial number: 1030; Categories: IC; Value: OPA301AIDBVT; COMPONENTLINK 1 DESCRIPTION: OpenDatasheet; Modify time: 2018年12月8号; Part Number: 101IF-00183BN.01; Category: 运放IC; PACKAGE: Tape&Reel; Mounting Type: SurfaceMount; Supplier 1: TI; Supplier Part Number 1: OPA301AIDBVT; COMPONENTLINK 1 URL: http://www.ti.com/lit/ds/symlink/opa300.pdf
U7#1 = 101IC-00038AS.01: 安装方式SMD,SOT-23-5,5PIN,I2C接口，2Kb非易失EEPROM（工作电压1.7,V,~,5.5,V）; Allow Altenative Part: Y; serial number: 789; Categories: IC; COMPONENTLINK 1 DESCRIPTION: OpenDatasheet; Remark: 苏州; Modify time: 2018年3月3号; Part Number: 101IC-00038AS.01; Category: 存储器IC; Value: AT24C02C-STUM-T; PACKAGE: Tape&Reel; Mounting Type: SurfaceMount; Supplier 1: Microchip; Supplier Part Number 1: AT24C02C-STUM-T; COMPONENTLINK 1 URL: http://ww1.microchip.com/downloads/en/DeviceDoc/Atmel-8700-SEEPROM-AT24C01C-02C-Datasheet.pdf
U8 = 101IA-00047BN.01: SMD,SOT-23-5,5PIN,线性稳压器(输入电压2.2V~5.5V,输出电压3.3V,输出电流250mA); Allow Altenative Part: Y; serial number: 58; Categories: IC; Value: LP5907MFX-3.3/NOPB; COMPONENTLINK 1 DESCRIPTION: OpenDatasheet; Remark: Verified by BU2（叶俊雄） check list V1.0; Modify time: 2015年07月10号; Approved: YES; Part Number: 101IA-00047BN.01; Category: 电源管理IC; PACKAGE: Tape&Reel; Mounting Type: SurfaceMount; Supplier 1: TI; Supplier Part Number 1: LP5907MFX-3.3/NOPB; Pricing 1: 0.158; COMPONENTLINK 1 URL: http://pdf1.alldatasheet.com/datasheet-pdf/view/477973/TI1/LP5907MFX-3.3-NOPB/+357985VRh7aLSYDADTMfIEzGMc+fy+/datasheet.pdf; MOQ: 5000